# Altium schematic sheet PANEL.SchDoc
size A; DrawnBy: SURAJ; SheetNumber: 5
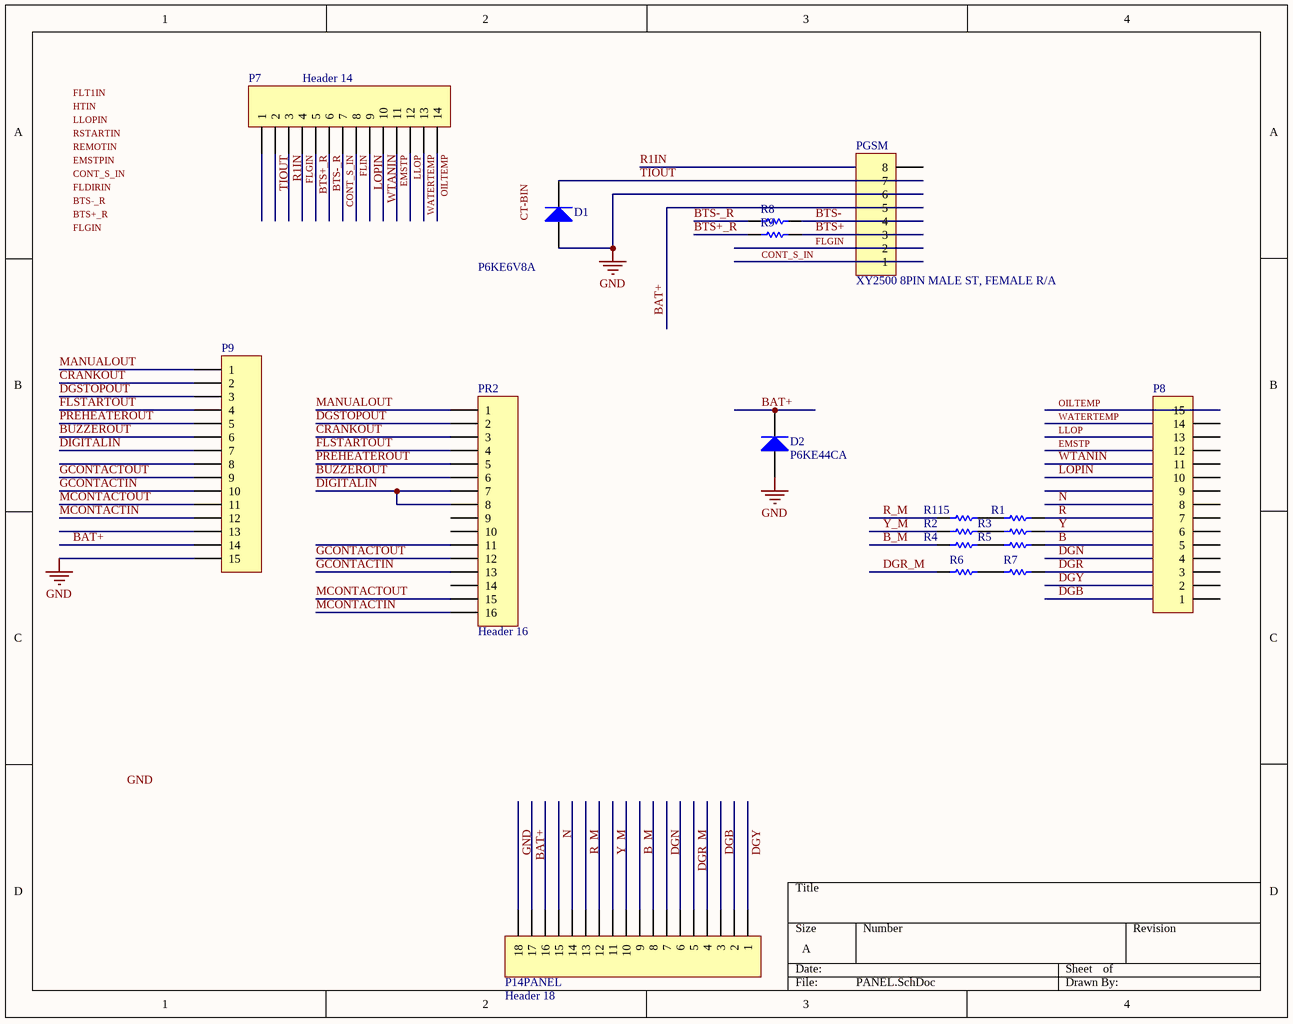
[diagram p0: PANEL.SchDoc]

## Parts
D1  P6KE6V8A  [DIODE1A]
D2  P6KE44CA  [DIODE1A]
P7  Header 14  [HDR1X14_BURGE_M]
P8  XY2500 7PIN+8PIN MALE ST, FEMALE R/A  [XY2500_15PIN_M_ST]  (value not drawn)
P9  XY2500 7PIN+8PIN MALE ST, FEMALE R/A  [XY2500_15PIN_M_ST]  (value not drawn)
P14PANEL  Header 18  [HDR1X18_BURGE_M]
PGSM  XY2500 8PIN MALE ST, FEMALE R/A  [XY2500_8PIN_M_ST]
PR2  Header 16  [HDR1X16_BURGE_F]
R1  MFR 1M .5W  [AXIAL-0.5]  (value not drawn)
R2  MFR 1M .5W  [AXIAL-0.5]  (value not drawn)
R3  MFR 1M .5W  [AXIAL-0.5]  (value not drawn)
R4  MFR 1M .5W  [AXIAL-0.5]  (value not drawn)
R5  MFR 1M .5W  [AXIAL-0.5]  (value not drawn)
R6  MFR 1M .5W  [AXIAL-0.5]  (value not drawn)
R7  MFR 1M .5W  [AXIAL-0.5]  (value not drawn)
R8  MFR 1M .5W  [AXIAL-0.5]  (value not drawn)
R9  MFR 1M .5W  [AXIAL-0.5]  (value not drawn)
R115  MFR 1M .5W  [AXIAL-0.5]  (value not drawn)

## Nets
GND: D1.1(A) D2.1(A) P9.15 P14PANEL.18 PGSM.6
B: P8.5 R5.2
B_M: P14PANEL.9 R4.1
BAT+: D2.2(K) P9.14 P14PANEL.17 PGSM.5
BTS+: PGSM.3 R9.2
BTS+_R: P7.5 R9.1
BTS-: PGSM.4 R8.2
BTS-_R: P7.6 R8.1
BUZZEROUT: P9.6 PR2.6
CONT_S_IN: P7.7 PGSM.1
CRANKOUT: P9.2 PR2.3
DGB: P8.1 P14PANEL.3
DGN: P8.4 P14PANEL.7
DGR: P8.3 R7.2
DGR_M: P14PANEL.5 R6.1
DGSTOPOUT: P9.3 PR2.2
DGY: P8.2 P14PANEL.1
DIGITALIN: P9.7 PR2.7 PR2.8
EMSTP: P7.11 P8.12
FLGIN: P7.4 PGSM.2
FLIN: P7.8
FLSTARTOUT: P9.4 PR2.4
GCONTACTIN: P9.10 PR2.13
GCONTACTOUT: P9.9 PR2.12
LLOP: P7.12 P8.13
LOPIN: P7.9 P8.10
MANUALOUT: P9.1 PR2.1
MCONTACTIN: P9.12 PR2.16
MCONTACTOUT: P9.11 PR2.15
N: P8.8 P14PANEL.15
OILTEMP: P7.14 P8.15
PREHEATEROUT: P9.5 PR2.5
R: P8.7 R1.2
R1IN: P7.3 PGSM.8
R_M: P14PANEL.13 R115.1
TIOUT: D1.2(K) P7.2 PGSM.7
WATERTEMP: P7.13 P8.14
WTANIN: P7.10 P8.11
Y: P8.6 R3.2
Y_M: P14PANEL.11 R2.1
NetR1_1: R1.1 R115.2
NetR2_2: R2.2 R3.1
NetR4_2: R4.2 R5.1
NetR6_2: R6.2 R7.1

Not connected (* = marked no-connect by the designer): P7 1; P8 9; P9 8 13; P14PANEL 2 4 6 8 10 12 14 16; PR2 9 10 11 14

## Notes on the sheet
- Labels drawn without touching a wire or pin: BTS+_R, BTS-_R, CONT_S_IN, CT-BIN, EMSTPIN, FLDIRIN, FLGIN, FLT1IN, GND, HTIN, LLOPIN, REMOTIN, RSTARTIN

## Library data of the parts
D1 D2 = Diode 1N5408: 3 Amp Medium Power Silicon Rectifier Diode; Published: 8-Jun-2000; LatestRevisionDate: 17-Jul-2002; LatestRevisionNote: Re-released for DXP Platform.; DatasheetVersion: Aug-1984; PackageReference: DO-201AD; Publisher: Altium Limited; PackageDescription: Diode, Axial; Body 9.5 x 5.3 mm (LxDia. max), Lead Dia. 1.32 mm (max); ComponentLink1Description: Manufacturer Link; ComponentLink1URL: http://www.irf.com/
P7 = Header 14: Header, 14-Pin; LatestRevisionDate: 17-Jul-2002; LatestRevisionNote: Re-released for DXP Platform.; Publisher: Altium Limited
P8 P9 = Header 15: Header, 15-Pin; LatestRevisionDate: 17-Jul-2002; LatestRevisionNote: Re-released for DXP Platform.; Publisher: Altium Limited
P14PANEL = Header 18: Header, 18-Pin; LatestRevisionDate: 17-Jul-2002; LatestRevisionNote: Re-released for DXP Platform.; Publisher: Altium Limited
PGSM = Header 8: Header, 8-Pin; LatestRevisionDate: 17-Jul-2002; LatestRevisionNote: Re-released for DXP Platform.; Publisher: Altium Limited
PR2 = Header 16: Header, 16-Pin; LatestRevisionDate: 17-Jul-2002; LatestRevisionNote: Re-released for DXP Platform.; Publisher: Altium Limited
R1-R9 R115 = Res Semi: Semiconductor Resistor; Value: 100K; Published: 8-Jun-2000; LatestRevisionDate: 17-Jul-2002; LatestRevisionNote: Re-released for DXP Platform.; PackageReference: AXIAL-0.5; Publisher: Altium Limited; PackageDescription: Axial Device, Thru-Hole; 2 Leads; 0.5 in Pin Spacing